# EAGLE schematic radiata_v1 (EAGLE 6.4)
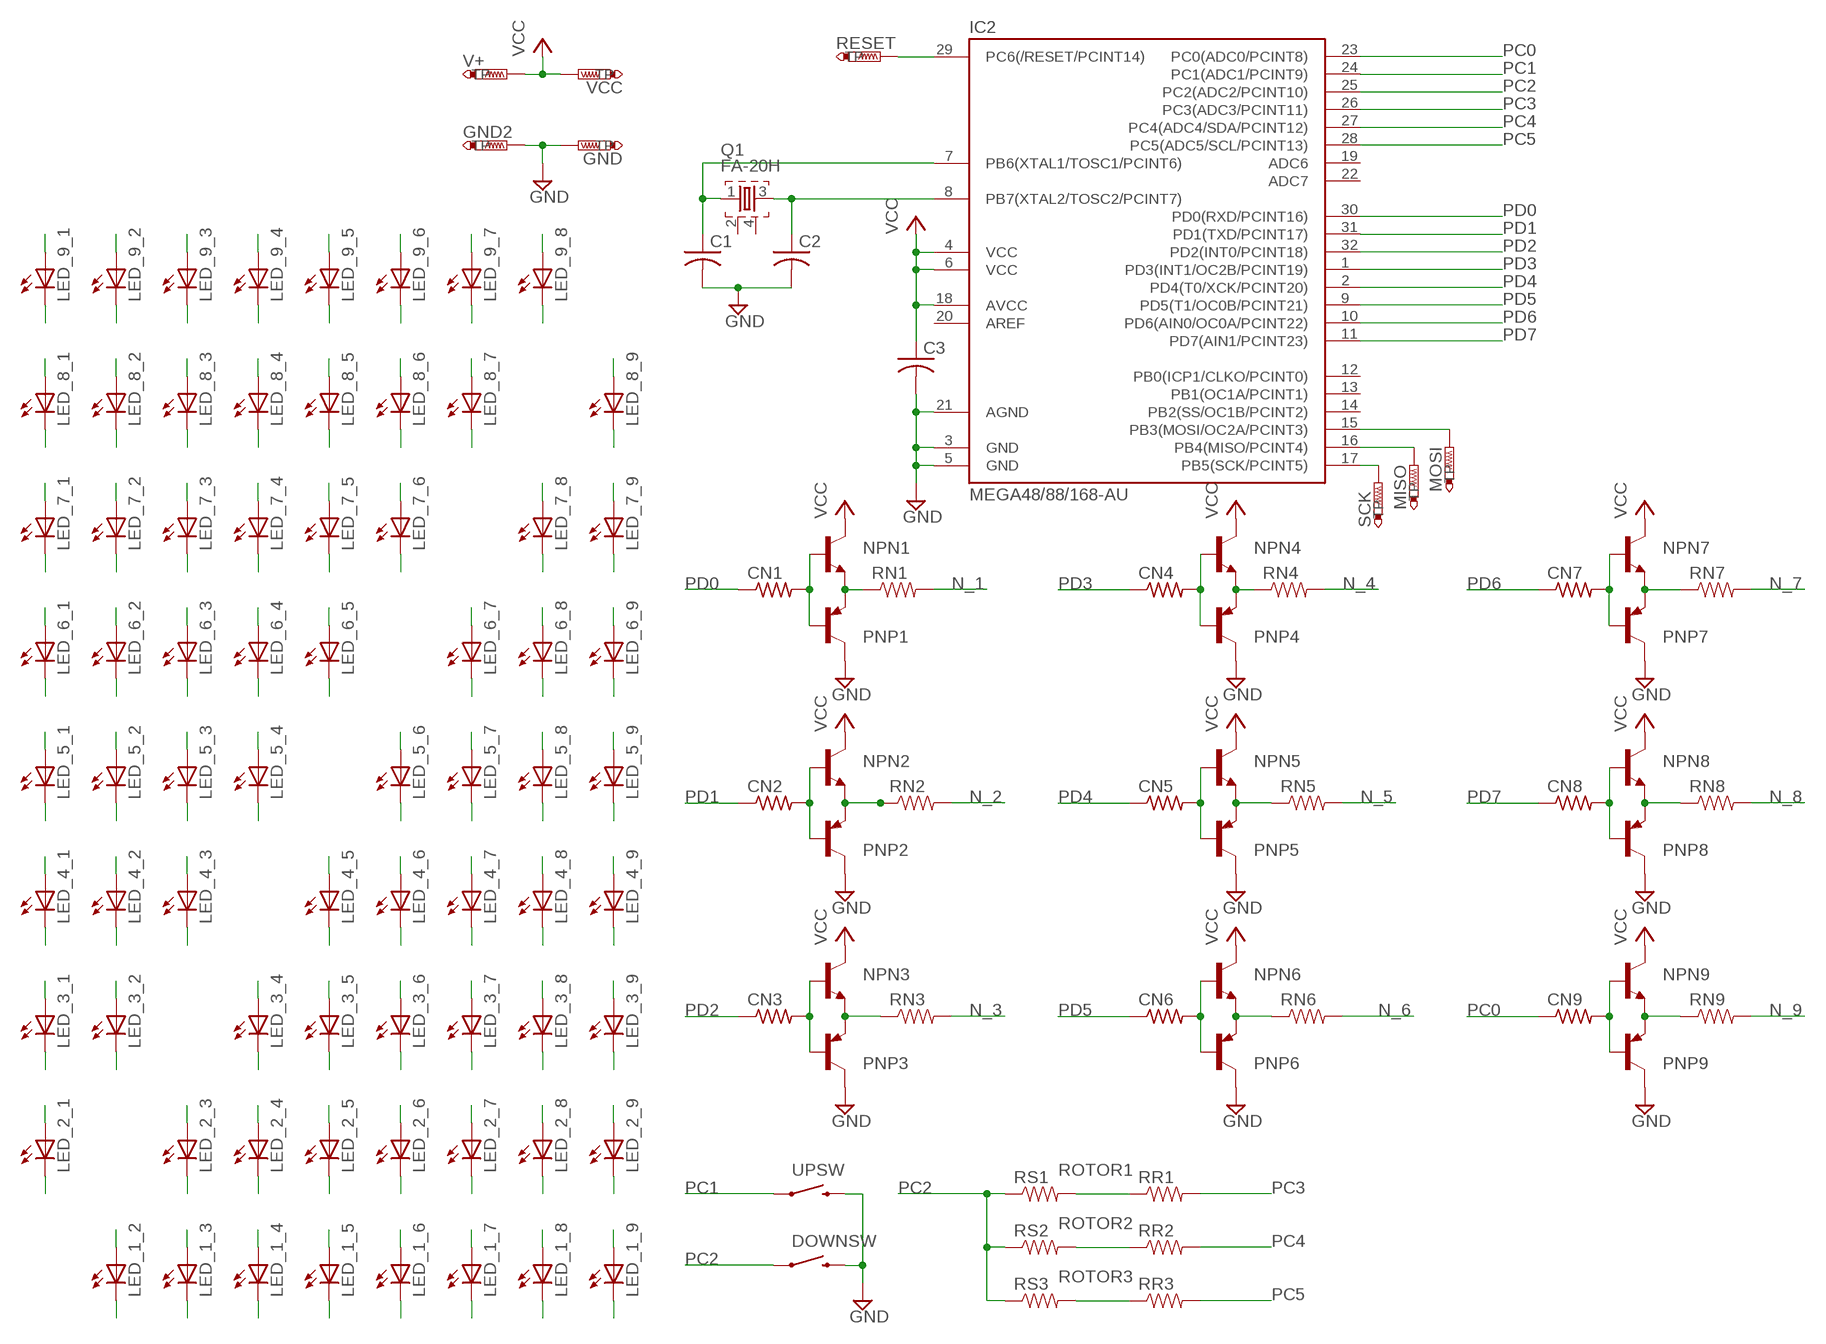
[diagram p0: schematic, sheet 1]

## Parts
C1  C-USC0603  [C0603]
C2  C-USC0603  [C0603]
C3  C-USC0603  [C0603]
CN1  R-US_M0805  [M0805]
CN2  R-US_M0805  [M0805]
CN3  R-US_M0805  [M0805]
CN4  R-US_M0805  [M0805]
CN5  R-US_M0805  [M0805]
CN6  R-US_M0805  [M0805]
CN7  R-US_M0805  [M0805]
CN8  R-US_M0805  [M0805]
CN9  R-US_M0805  [M0805]
DOWNSW  SWITCH-MOMENTARY-2  [TACTILE_SWITCH_TALL]
GND  PTR1TP19R  [TP19R]
GND2  PTR1TP20SQ  [TP20SQ]
IC2  MEGA48/88/168-AU  [TQFP32-08]
LED_1_2  LEDCHIPLED_1206  [CHIPLED_1206]
LED_1_3  LEDCHIPLED_1206  [CHIPLED_1206]
LED_1_4  LEDCHIPLED_1206  [CHIPLED_1206]
LED_1_5  LEDCHIPLED_1206  [CHIPLED_1206]
LED_1_6  LEDCHIPLED_1206  [CHIPLED_1206]
LED_1_7  LEDCHIPLED_1206  [CHIPLED_1206]
LED_1_8  LEDCHIPLED_1206  [CHIPLED_1206]
LED_1_9  LEDCHIPLED_1206  [CHIPLED_1206]
LED_2_1  LEDCHIPLED_1206  [CHIPLED_1206]
LED_2_3  LEDCHIPLED_1206  [CHIPLED_1206]
LED_2_4  LEDCHIPLED_1206  [CHIPLED_1206]
LED_2_5  LEDCHIPLED_1206  [CHIPLED_1206]
LED_2_6  LEDCHIPLED_1206  [CHIPLED_1206]
LED_2_7  LEDCHIPLED_1206  [CHIPLED_1206]
LED_2_8  LEDCHIPLED_1206  [CHIPLED_1206]
LED_2_9  LEDCHIPLED_1206  [CHIPLED_1206]
LED_3_1  LEDCHIPLED_1206  [CHIPLED_1206]
LED_3_2  LEDCHIPLED_1206  [CHIPLED_1206]
LED_3_4  LEDCHIPLED_1206  [CHIPLED_1206]
LED_3_5  LEDCHIPLED_1206  [CHIPLED_1206]
LED_3_6  LEDCHIPLED_1206  [CHIPLED_1206]
LED_3_7  LEDCHIPLED_1206  [CHIPLED_1206]
LED_3_8  LEDCHIPLED_1206  [CHIPLED_1206]
LED_3_9  LEDCHIPLED_1206  [CHIPLED_1206]
LED_4_1  LEDCHIPLED_1206  [CHIPLED_1206]
LED_4_2  LEDCHIPLED_1206  [CHIPLED_1206]
LED_4_3  LEDCHIPLED_1206  [CHIPLED_1206]
LED_4_5  LEDCHIPLED_1206  [CHIPLED_1206]
LED_4_6  LEDCHIPLED_1206  [CHIPLED_1206]
LED_4_7  LEDCHIPLED_1206  [CHIPLED_1206]
LED_4_8  LEDCHIPLED_1206  [CHIPLED_1206]
LED_4_9  LEDCHIPLED_1206  [CHIPLED_1206]
LED_5_1  LEDCHIPLED_1206  [CHIPLED_1206]
LED_5_2  LEDCHIPLED_1206  [CHIPLED_1206]
LED_5_3  LEDCHIPLED_1206  [CHIPLED_1206]
LED_5_4  LEDCHIPLED_1206  [CHIPLED_1206]
LED_5_6  LEDCHIPLED_1206  [CHIPLED_1206]
LED_5_7  LEDCHIPLED_1206  [CHIPLED_1206]
LED_5_8  LEDCHIPLED_1206  [CHIPLED_1206]
LED_5_9  LEDCHIPLED_1206  [CHIPLED_1206]
LED_6_1  LEDCHIPLED_1206  [CHIPLED_1206]
LED_6_2  LEDCHIPLED_1206  [CHIPLED_1206]
LED_6_3  LEDCHIPLED_1206  [CHIPLED_1206]
LED_6_4  LEDCHIPLED_1206  [CHIPLED_1206]
LED_6_5  LEDCHIPLED_1206  [CHIPLED_1206]
LED_6_7  LEDCHIPLED_1206  [CHIPLED_1206]
LED_6_8  LEDCHIPLED_1206  [CHIPLED_1206]
LED_6_9  LEDCHIPLED_1206  [CHIPLED_1206]
LED_7_1  LEDCHIPLED_1206  [CHIPLED_1206]
LED_7_2  LEDCHIPLED_1206  [CHIPLED_1206]
LED_7_3  LEDCHIPLED_1206  [CHIPLED_1206]
LED_7_4  LEDCHIPLED_1206  [CHIPLED_1206]
LED_7_5  LEDCHIPLED_1206  [CHIPLED_1206]
LED_7_6  LEDCHIPLED_1206  [CHIPLED_1206]
LED_7_8  LEDCHIPLED_1206  [CHIPLED_1206]
LED_7_9  LEDCHIPLED_1206  [CHIPLED_1206]
LED_8_1  LEDCHIPLED_1206  [CHIPLED_1206]
LED_8_2  LEDCHIPLED_1206  [CHIPLED_1206]
LED_8_3  LEDCHIPLED_1206  [CHIPLED_1206]
LED_8_4  LEDCHIPLED_1206  [CHIPLED_1206]
LED_8_5  LEDCHIPLED_1206  [CHIPLED_1206]
LED_8_6  LEDCHIPLED_1206  [CHIPLED_1206]
LED_8_7  LEDCHIPLED_1206  [CHIPLED_1206]
LED_8_9  LEDCHIPLED_1206  [CHIPLED_1206]
LED_9_1  LEDCHIPLED_1206  [CHIPLED_1206]
LED_9_2  LEDCHIPLED_1206  [CHIPLED_1206]
LED_9_3  LEDCHIPLED_1206  [CHIPLED_1206]
LED_9_4  LEDCHIPLED_1206  [CHIPLED_1206]
LED_9_5  LEDCHIPLED_1206  [CHIPLED_1206]
LED_9_6  LEDCHIPLED_1206  [CHIPLED_1206]
LED_9_7  LEDCHIPLED_1206  [CHIPLED_1206]
LED_9_8  LEDCHIPLED_1206  [CHIPLED_1206]
MISO  PTR1TP19R  [TP19R]
MOSI  PTR1TP19R  [TP19R]
NPN1  MMBT2222ALT1-NPN-SOT23-BEC  [SOT23-BEC]
NPN2  MMBT2222ALT1-NPN-SOT23-BEC  [SOT23-BEC]
NPN3  MMBT2222ALT1-NPN-SOT23-BEC  [SOT23-BEC]
NPN4  MMBT2222ALT1-NPN-SOT23-BEC  [SOT23-BEC]
NPN5  MMBT2222ALT1-NPN-SOT23-BEC  [SOT23-BEC]
NPN6  MMBT2222ALT1-NPN-SOT23-BEC  [SOT23-BEC]
NPN7  MMBT2222ALT1-NPN-SOT23-BEC  [SOT23-BEC]
NPN8  MMBT2222ALT1-NPN-SOT23-BEC  [SOT23-BEC]
NPN9  MMBT2222ALT1-NPN-SOT23-BEC  [SOT23-BEC]
PNP1  MMBT2907ALT1-PNP-SOT23-BEC  [SOT23-BEC]
PNP2  MMBT2907ALT1-PNP-SOT23-BEC  [SOT23-BEC]
PNP3  MMBT2907ALT1-PNP-SOT23-BEC  [SOT23-BEC]
PNP4  MMBT2907ALT1-PNP-SOT23-BEC  [SOT23-BEC]
PNP5  MMBT2907ALT1-PNP-SOT23-BEC  [SOT23-BEC]
PNP6  MMBT2907ALT1-PNP-SOT23-BEC  [SOT23-BEC]
PNP7  MMBT2907ALT1-PNP-SOT23-BEC  [SOT23-BEC]
PNP8  MMBT2907ALT1-PNP-SOT23-BEC  [SOT23-BEC]
PNP9  MMBT2907ALT1-PNP-SOT23-BEC  [SOT23-BEC]
Q1  FA-20H  [FA-20H]
RESET  PTR1TP19R  [TP19R]
RN1  RESISTOR1206  [1206]
RN2  RESISTOR1206  [1206]
RN3  RESISTOR1206  [1206]
RN4  RESISTOR1206  [1206]
RN5  RESISTOR1206  [1206]
RN6  RESISTOR1206  [1206]
RN7  RESISTOR1206  [1206]
RN8  RESISTOR1206  [1206]
RN9  RESISTOR1206  [1206]
RR1  RESISTOR1206  [1206]
RR2  RESISTOR1206  [1206]
RR3  RESISTOR1206  [1206]
RS1  RESISTOR1206  [1206]
RS2  RESISTOR1206  [1206]
RS3  RESISTOR1206  [1206]
SCK  PTR1TP19R  [TP19R]
UPSW  SWITCH-MOMENTARY-2  [TACTILE_SWITCH_TALL]
V+  PTR1TP20SQ  [TP20SQ]
VCC  PTR1TP19R  [TP19R]

## Nets
GND: C1.2 C2.2 C3.2 DOWNSW.B2 GND2.TP GND.TP IC2.3(GND) IC2.5(GND) IC2.21(AGND) PNP1.C PNP2.C PNP3.C PNP4.C PNP5.C PNP6.C PNP7.C PNP8.C PNP9.C UPSW.B2
N$5: IC2.29(PC6(/RESET/PCINT14)) RESET.TP
N$6: IC2.17(PB5(SCK/PCINT5)) SCK.TP
N$7: IC2.16(PB4(MISO/PCINT4)) MISO.TP
N$8: IC2.15(PB3(MOSI/OC2A/PCINT3)) MOSI.TP
N$9: NPN1.E PNP1.E RN1.1
N$10: CN1.2 NPN1.B PNP1.B
N$11: NPN2.E PNP2.E RN2.1
N$12: CN2.2 NPN2.B PNP2.B
N$13: NPN3.E PNP3.E RN3.1
N$14: CN3.2 NPN3.B PNP3.B
N$15: NPN4.E PNP4.E RN4.1
N$16: CN4.2 NPN4.B PNP4.B
N$17: NPN5.E PNP5.E RN5.1
N$18: CN5.2 NPN5.B PNP5.B
N$19: NPN6.E PNP6.E RN6.1
N$20: CN6.2 NPN6.B PNP6.B
N$24: NPN7.E PNP7.E RN7.1
N$25: CN7.2 NPN7.B PNP7.B
N$26: NPN8.E PNP8.E RN8.1
N$27: CN8.2 NPN8.B PNP8.B
N$28: NPN9.E PNP9.E RN9.1
N$29: CN9.2 NPN9.B PNP9.B
N_1: LED_1_2.A LED_1_3.A LED_1_4.A LED_1_5.A LED_1_6.A LED_1_7.A LED_1_8.A LED_1_9.A LED_2_1.C LED_3_1.C LED_4_1.C LED_5_1.C LED_6_1.C LED_7_1.C LED_8_1.C LED_9_1.C RN1.2
N_2: LED_1_2.C LED_2_1.A LED_2_3.A LED_2_4.A LED_2_5.A LED_2_6.A LED_2_7.A LED_2_8.A LED_2_9.A LED_3_2.C LED_4_2.C LED_5_2.C LED_6_2.C LED_7_2.C LED_8_2.C LED_9_2.C RN2.2
N_3: LED_1_3.C LED_2_3.C LED_3_1.A LED_3_2.A LED_3_4.A LED_3_5.A LED_3_6.A LED_3_7.A LED_3_8.A LED_3_9.A LED_4_3.C LED_5_3.C LED_6_3.C LED_7_3.C LED_8_3.C LED_9_3.C RN3.2
N_4: LED_1_4.C LED_2_4.C LED_3_4.C LED_4_1.A LED_4_2.A LED_4_3.A LED_4_5.A LED_4_6.A LED_4_7.A LED_4_8.A LED_4_9.A LED_5_4.C LED_6_4.C LED_7_4.C LED_8_4.C LED_9_4.C RN4.2
N_5: LED_1_5.C LED_2_5.C LED_3_5.C LED_4_5.C LED_5_1.A LED_5_2.A LED_5_3.A LED_5_4.A LED_5_6.A LED_5_7.A LED_5_8.A LED_5_9.A LED_6_5.C LED_7_5.C LED_8_5.C LED_9_5.C RN5.2
N_6: LED_1_6.C LED_2_6.C LED_3_6.C LED_4_6.C LED_5_6.C LED_6_1.A LED_6_2.A LED_6_3.A LED_6_4.A LED_6_5.A LED_6_7.A LED_6_8.A LED_6_9.A LED_7_6.C LED_8_6.C LED_9_6.C RN6.2
N_7: LED_1_7.C LED_2_7.C LED_3_7.C LED_4_7.C LED_5_7.C LED_6_7.C LED_7_1.A LED_7_2.A LED_7_3.A LED_7_4.A LED_7_5.A LED_7_6.A LED_7_8.A LED_7_9.A LED_8_7.C LED_9_7.C RN7.2
N_8: LED_1_8.C LED_2_8.C LED_3_8.C LED_4_8.C LED_5_8.C LED_6_8.C LED_7_8.C LED_8_1.A LED_8_2.A LED_8_3.A LED_8_4.A LED_8_5.A LED_8_6.A LED_8_7.A LED_8_9.A LED_9_8.C RN8.2
N_9: LED_1_9.C LED_2_9.C LED_3_9.C LED_4_9.C LED_5_9.C LED_6_9.C LED_7_9.C LED_8_9.C LED_9_1.A LED_9_2.A LED_9_3.A LED_9_4.A LED_9_5.A LED_9_6.A LED_9_7.A LED_9_8.A RN9.2
PB0: C2.1 IC2.8(PB7(XTAL2/TOSC2/PCINT7)) Q1.3
PB1: C1.1 IC2.7(PB6(XTAL1/TOSC1/PCINT6)) Q1.1
PC0: CN9.1 IC2.23(PC0(ADC0/PCINT8))
PC1: IC2.24(PC1(ADC1/PCINT9)) UPSW.A2
PC2: DOWNSW.A2 IC2.25(PC2(ADC2/PCINT10)) RS1.1 RS2.1 RS3.1
PC3: IC2.26(PC3(ADC3/PCINT11)) RR1.2
PC4: IC2.27(PC4(ADC4/SDA/PCINT12)) RR2.2
PC5: IC2.28(PC5(ADC5/SCL/PCINT13)) RR3.2
PD0: CN1.1 IC2.30(PD0(RXD/PCINT16))
PD1: CN2.1 IC2.31(PD1(TXD/PCINT17))
PD2: CN3.1 IC2.32(PD2(INT0/PCINT18))
PD3: CN4.1 IC2.1(PD3(INT1/OC2B/PCINT19))
PD4: CN5.1 IC2.2(PD4(T0/XCK/PCINT20))
PD5: CN6.1 IC2.9(PD5(T1/OC0B/PCINT21))
PD6: CN7.1 IC2.10(PD6(AIN0/OC0A/PCINT22))
PD7: CN8.1 IC2.11(PD7(AIN1/PCINT23))
ROTOR1: RR1.1 RS1.2
ROTOR2: RR2.1 RS2.2
ROTOR3: RR3.1 RS3.2
VCC: C3.1 IC2.4(VCC) IC2.6(VCC) IC2.18(AVCC) NPN1.C NPN2.C NPN3.C NPN4.C NPN5.C NPN6.C NPN7.C NPN8.C NPN9.C V+.TP VCC.TP
Unconnected: IC2.12(PB0(ICP1/CLKO/PCINT0)) IC2.13(PB1(OC1A/PCINT1)) IC2.14(PB2(SS/OC1B/PCINT2)) IC2.19(ADC6) IC2.20(AREF) IC2.22(ADC7) Q1.2 Q1.4

## Library data of the parts
C1-C3 = rcl:C-US: CAPACITOR, American symbol
CN1-CN9 = rcl:R-US_: RESISTOR, American symbol
DOWNSW UPSW = SparkFun:SWITCH-MOMENTARY-2
GND GND2 MISO MOSI RESET SCK V+ VCC = testpad:PTR1: TEST PIN
IC2 = avr-7:MEGA48/88/168
LED_1_2-LED_1_9 LED_2_1 LED_2_3-LED_2_9 LED_3_1 LED_3_2 LED_3_4-LED_3_9 LED_4_1-LED_4_3 LED_4_5-LED_4_9 LED_5_1-LED_5_4 LED_5_6-LED_5_9 LED_6_1-LED_6_5 LED_6_7-LED_6_9 LED_7_1-LED_7_6 LED_7_8 LED_7_9 LED_8_1-LED_8_7 LED_8_9 LED_9_1-LED_9_8 = led:LED: LED OSRAM: - CHIPLED LG R971, LG N971, LY N971, LG Q971, LY Q971, LO R971, LY R971 LH N974, LH R974 LS Q976, LO Q976, LY Q976 LO Q996 - Hyper CHIPLED LW Q18S LB Q993, LB Q99A, LB R99A - SideLED LS A670, LO A670, LY A670, LG A670, LP A670 LB A673, LV A673, LT A673, LW A673 LH A674 LY A675 LS A676, LA A676, LO A676, LY A676, LW A676 LS A679, LY A679, LG A679 - Hyper Micro SIDELED® LS Y876, LA Y876, LO Y876, LY Y876 LT Y87S - SmartLED LW L88C, LW L88S LB L89C, LB L89S, LG L890 LS L89K, LO L89K, LY L89K LS L896, LA L896, LO L896, LY L896 - TOPLED LS T670, LO T670, LY T670, LG T670, LP T670 LSG T670, LSP T670, LSY T670, LOP T670, LYG T670 LG T671, LOG T671, LSG T671 LB T673, LV T673, LT T673, LW T673 LH T674 LS T676, LA T676, LO T676, LY T676, LB T676, LH T676, LSB T676, LW T676 LB T67C, LV T67C, LT T67C, LS T67K, LO T67K, LY T67K, LW E67C LS E67B, LA E67B, LO E67B, LY E67B, LB E67C, LV E67C, LT E67C LW T67C LS T679, LY T679, LG T679 LS T770, LO T770, LY T770, LG T770, LP T770 LB T773, LV T773, LT T773, LW T773 LH T774 LS E675, LA E675, LY E675, LS T675 LS T776, LA T776, LO T776, LY T776, LB T776 LHGB T686 LT T68C, LB T68C - Hyper Mini TOPLED® LB M676 - Mini TOPLED Santana® LG M470 LS M47K, LO M47K, LY M47K Source: http://www.osram.convergy.de LUXEON: - LUMILED® LXK2-PW12-R00, LXK2-PW12-S00, LXK2-PW14-U00, LXK2-PW14-V00 LXK2-PM12-R00, LXK2-PM12-S00, LXK2-PM14-U00 LXK2-PE12-Q00, LXK2-PE12-R00, LXK2-PE12-S00, LXK2-PE14-T00, LXK2-PE14-U00 LXK2-PB12-K00, LXK2-PB12-L00, LXK2-PB12-M00, LXK2-PB14-N00, LXK2-PB14-P00, LXK2-PB14-Q00 LXK2-PR12-L00, LXK2-PR12-M00, LXK2-PR14-Q00, LXK2-PR14-R00 LXK2-PD12-Q00, LXK2-PD12-R00, LXK2-PD12-S00 LXK2-PH12-R00, LXK2-PH12-S00 LXK2-PL12-P00, LXK2-PL12-Q00, LXK2-PL12-R00 Source: www.luxeon.com KINGBRIGHT: KA-3528ASYC Source: www.kingbright.com
NPN1-NPN9 = transistor:*-NPN-: NPN Transistror BF959 corrected 2008.03.06
PNP1-PNP9 = transistor:*-PNP-: PNP Transistror
Q1 = crystal:FA-: MHz RANGE CRYSTAL UNIT Source: Epson Toyocom
RN1-RN9 RR1-RR3 RS1-RS3 = SparkFun:RESISTOR: Resistor Basic schematic elements and footprints for 0603, 1206, and PTH resistors.